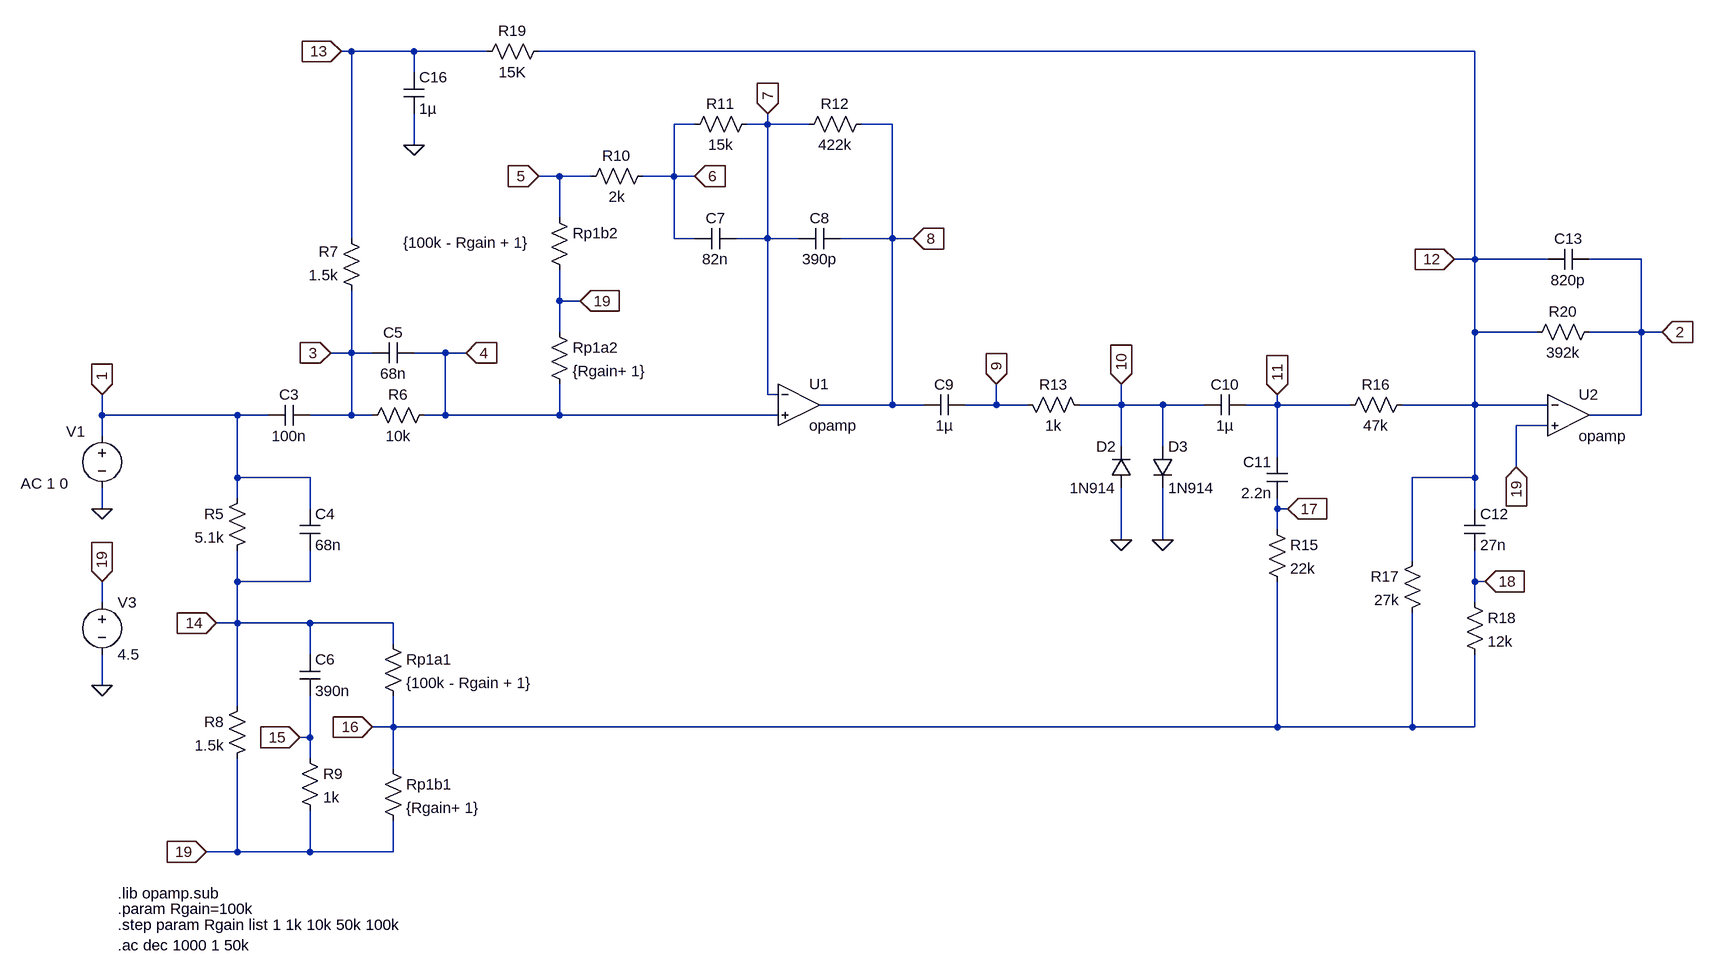
[diagram p0: schematic Klon-Centaur_gain_wo_diodes.asc]
Klon-Centaur_gain_wo_diodes.asc, the LTspice schematic file:
Version 4
SHEET 1 4496 5064
WIRE -32 2000 -48 2000
WIRE 64 2000 -32 2000
WIRE 176 2000 64 2000
WIRE 1696 2000 256 2000
WIRE 64 2032 64 2000
WIRE 496 2112 464 2112
WIRE 608 2112 608 2096
WIRE 608 2112 576 2112
WIRE 672 2112 608 2112
WIRE 800 2112 752 2112
WIRE 64 2144 64 2096
WIRE 288 2192 256 2192
WIRE 336 2192 288 2192
WIRE 464 2192 464 2112
WIRE 464 2192 416 2192
WIRE 496 2192 464 2192
WIRE 288 2256 288 2192
WIRE -32 2288 -32 2000
WIRE 464 2288 464 2192
WIRE 496 2288 464 2288
WIRE 608 2288 608 2112
WIRE 608 2288 560 2288
WIRE 656 2288 608 2288
WIRE 800 2288 800 2112
WIRE 800 2288 720 2288
WIRE 832 2288 800 2288
WIRE 1696 2320 1696 2000
WIRE 1696 2320 1664 2320
WIRE 1808 2320 1696 2320
WIRE 1952 2320 1872 2320
WIRE 288 2384 288 2336
WIRE 320 2384 288 2384
WIRE 288 2432 288 2384
WIRE 1696 2432 1696 2320
WIRE 1792 2432 1696 2432
WIRE 1952 2432 1952 2320
WIRE 1952 2432 1872 2432
WIRE 1984 2432 1952 2432
WIRE -32 2464 -32 2368
WIRE -32 2464 -64 2464
WIRE 0 2464 -32 2464
WIRE 112 2464 64 2464
WIRE 144 2464 112 2464
WIRE 608 2528 608 2288
WIRE 624 2528 608 2528
WIRE 800 2544 800 2288
WIRE 800 2544 688 2544
WIRE 848 2544 800 2544
WIRE 960 2544 960 2512
WIRE 960 2544 912 2544
WIRE 1008 2544 960 2544
WIRE 1152 2544 1152 2512
WIRE 1152 2544 1088 2544
WIRE 1216 2544 1152 2544
WIRE 1280 2544 1216 2544
WIRE 1392 2544 1392 2528
WIRE 1392 2544 1344 2544
WIRE 1504 2544 1392 2544
WIRE 1696 2544 1696 2432
WIRE 1696 2544 1584 2544
WIRE 1808 2544 1696 2544
WIRE -416 2560 -416 2528
WIRE -208 2560 -416 2560
WIRE -160 2560 -208 2560
WIRE -32 2560 -32 2464
WIRE -32 2560 -96 2560
WIRE 0 2560 -32 2560
WIRE 112 2560 112 2464
WIRE 112 2560 80 2560
WIRE 288 2560 288 2512
WIRE 288 2560 112 2560
WIRE 624 2560 288 2560
WIRE 1952 2560 1952 2432
WIRE 1952 2560 1872 2560
WIRE 1808 2576 1760 2576
WIRE -416 2592 -416 2560
WIRE 1152 2608 1152 2544
WIRE 1216 2608 1216 2544
WIRE 1392 2624 1392 2544
WIRE 1760 2640 1760 2576
WIRE -208 2656 -208 2560
WIRE -96 2656 -208 2656
WIRE 1696 2656 1696 2544
WIRE 1696 2656 1600 2656
WIRE -208 2688 -208 2656
WIRE -416 2704 -416 2672
WIRE -96 2704 -96 2656
WIRE 1392 2704 1392 2688
WIRE 1408 2704 1392 2704
WIRE 1696 2704 1696 2656
WIRE 1392 2736 1392 2704
WIRE 1152 2752 1152 2672
WIRE 1216 2752 1216 2672
WIRE 1600 2784 1600 2656
WIRE -208 2816 -208 2768
WIRE -96 2816 -96 2768
WIRE -96 2816 -208 2816
WIRE 1696 2816 1696 2768
WIRE 1712 2816 1696 2816
WIRE -416 2848 -416 2816
WIRE 1696 2848 1696 2816
WIRE -208 2880 -208 2816
WIRE -208 2880 -240 2880
WIRE -96 2880 -208 2880
WIRE 32 2880 -96 2880
WIRE 32 2912 32 2880
WIRE -96 2928 -96 2880
WIRE -416 2976 -416 2928
WIRE -208 3008 -208 2880
WIRE 32 3040 32 2992
WIRE 32 3040 0 3040
WIRE 1392 3040 1392 2816
WIRE 1392 3040 32 3040
WIRE 1600 3040 1600 2864
WIRE 1600 3040 1392 3040
WIRE 1696 3040 1696 2928
WIRE 1696 3040 1600 3040
WIRE -96 3056 -96 2992
WIRE -96 3056 -112 3056
WIRE -96 3088 -96 3056
WIRE 32 3104 32 3040
WIRE -208 3232 -208 3088
WIRE -208 3232 -256 3232
WIRE -96 3232 -96 3168
WIRE -96 3232 -208 3232
WIRE 32 3232 32 3184
WIRE 32 3232 -96 3232
FLAG -256 3232 19
IOPIN -256 3232 In
FLAG -416 2528 1
IOPIN -416 2528 In
FLAG 320 2384 19
IOPIN 320 2384 In
FLAG 1216 2752 0
FLAG 1152 2752 0
FLAG 64 2144 0
FLAG 1760 2640 19
IOPIN 1760 2640 In
FLAG -416 2976 0
FLAG -416 2816 19
IOPIN -416 2816 In
FLAG -416 2704 0
FLAG -64 2464 3
IOPIN -64 2464 In
FLAG -48 2000 13
IOPIN -48 2000 In
FLAG 144 2464 4
IOPIN 144 2464 In
FLAG 256 2192 5
IOPIN 256 2192 In
FLAG 496 2192 6
IOPIN 496 2192 In
FLAG 608 2096 7
IOPIN 608 2096 In
FLAG 832 2288 8
IOPIN 832 2288 In
FLAG 960 2512 9
IOPIN 960 2512 In
FLAG 1152 2512 10
IOPIN 1152 2512 In
FLAG 1392 2528 11
IOPIN 1392 2528 In
FLAG 1408 2704 17
IOPIN 1408 2704 In
FLAG 1712 2816 18
IOPIN 1712 2816 In
FLAG 0 3040 16
IOPIN 0 3040 In
FLAG -112 3056 15
IOPIN -112 3056 In
FLAG -240 2880 14
IOPIN -240 2880 In
FLAG 1664 2320 12
IOPIN 1664 2320 In
FLAG 1984 2432 2
IOPIN 1984 2432 In
SYMBOL voltage -416 2576 R0
WINDOW 0 -55 9 Left 2
WINDOW 123 -125 89 Left 2
WINDOW 39 0 0 Left 0
WINDOW 3 -289 58 Left 2
SYMATTR InstName V1
SYMATTR Value2 AC 1 0
SYMATTR Value ""
SYMBOL res -192 2672 M0
SYMATTR InstName R5
SYMATTR Value 5.1k
SYMBOL res -192 2992 M0
SYMATTR InstName R8
SYMATTR Value 1.5k
SYMBOL cap -96 2544 R90
WINDOW 0 0 32 VBottom 2
WINDOW 3 32 32 VTop 2
SYMATTR InstName C3
SYMATTR Value 100n
SYMBOL cap -112 2704 R0
SYMATTR InstName C4
SYMATTR Value 68n
SYMBOL cap -112 2928 R0
SYMATTR InstName C6
SYMATTR Value 390n
SYMBOL res -112 3072 R0
SYMATTR InstName R9
SYMATTR Value 1k
SYMBOL res 96 2544 R90
WINDOW 0 0 56 VBottom 2
WINDOW 3 32 56 VTop 2
SYMATTR InstName R6
SYMATTR Value 10k
SYMBOL cap 64 2448 R90
WINDOW 0 0 32 VBottom 2
WINDOW 3 32 32 VTop 2
SYMATTR InstName C5
SYMATTR Value 68n
SYMBOL res 16 2896 R0
SYMATTR InstName Rp1a1
SYMATTR Value {100k - Rgain + 1}
SYMBOL res 16 3088 R0
SYMATTR InstName Rp1b1
SYMATTR Value {Rgain+ 1}
SYMBOL res 272 2240 R0
WINDOW 3 -225 54 Left 2
SYMATTR Value {100k - Rgain + 1}
SYMATTR InstName Rp1b2
SYMBOL res 272 2416 R0
SYMATTR InstName Rp1a2
SYMATTR Value {Rgain+ 1}
SYMBOL res 432 2176 R90
WINDOW 0 0 56 VBottom 2
WINDOW 3 32 56 VTop 2
SYMATTR InstName R10
SYMATTR Value 2k
SYMBOL res 592 2096 R90
WINDOW 0 0 56 VBottom 2
WINDOW 3 32 56 VTop 2
SYMATTR InstName R11
SYMATTR Value 15k
SYMBOL cap 560 2272 R90
WINDOW 0 0 32 VBottom 2
WINDOW 3 32 32 VTop 2
SYMATTR InstName C7
SYMATTR Value 82n
SYMBOL cap 720 2272 R90
WINDOW 0 0 32 VBottom 2
WINDOW 3 32 32 VTop 2
SYMATTR InstName C8
SYMATTR Value 390p
SYMBOL res 768 2096 R90
WINDOW 0 0 56 VBottom 2
WINDOW 3 32 56 VTop 2
SYMATTR InstName R12
SYMATTR Value 422k
SYMBOL res 1104 2560 M270
WINDOW 0 32 56 VTop 2
WINDOW 3 0 56 VBottom 2
SYMATTR InstName R13
SYMATTR Value 1k
SYMBOL cap 1408 2624 M0
SYMATTR InstName C11
SYMATTR Value 2.2n
SYMBOL res 1376 2720 R0
SYMATTR InstName R15
SYMATTR Value 22k
SYMBOL res 1616 2768 M0
SYMATTR InstName R17
SYMATTR Value 27k
SYMBOL res 1680 2832 R0
SYMATTR InstName R18
SYMATTR Value 12k
SYMBOL cap 1680 2704 R0
SYMATTR InstName C12
SYMATTR Value 27n
SYMBOL res 1600 2528 R90
WINDOW 0 0 56 VBottom 2
WINDOW 3 32 56 VTop 2
SYMATTR InstName R16
SYMATTR Value 47k
SYMBOL res -16 2384 R180
WINDOW 0 36 76 Left 2
WINDOW 3 36 40 Left 2
SYMATTR InstName R7
SYMATTR Value 1.5k
SYMBOL res 272 1984 R90
WINDOW 0 0 56 VBottom 2
WINDOW 3 32 56 VTop 2
SYMATTR InstName R19
SYMATTR Value 15K
SYMBOL res 1888 2416 R90
WINDOW 0 0 56 VBottom 2
WINDOW 3 32 56 VTop 2
SYMATTR InstName R20
SYMATTR Value 392k
SYMBOL cap 1872 2304 R90
WINDOW 0 0 32 VBottom 2
WINDOW 3 32 32 VTop 2
SYMATTR InstName C13
SYMATTR Value 820p
SYMBOL voltage -416 2832 R0
WINDOW 123 0 0 Left 0
WINDOW 39 0 0 Left 0
SYMATTR InstName V3
SYMATTR Value 4.5
SYMBOL cap 48 2032 R0
SYMATTR InstName C16
SYMATTR Value 1µ
SYMBOL cap 1344 2528 R90
WINDOW 0 0 32 VBottom 2
WINDOW 3 32 32 VTop 2
SYMATTR InstName C10
SYMATTR Value 1µ
SYMBOL cap 912 2528 R90
WINDOW 0 0 32 VBottom 2
WINDOW 3 32 32 VTop 2
SYMATTR InstName C9
SYMATTR Value 1µ
SYMBOL OpAmps\\opamp 656 2480 R0
SYMATTR InstName U1
SYMBOL OpAmps\\opamp 1840 2496 R0
SYMATTR InstName U2
SYMBOL diode 1200 2608 R0
SYMATTR InstName D3
SYMATTR Value 1N914
SYMBOL diode 1168 2672 R180
WINDOW 0 24 64 Left 2
WINDOW 3 24 0 Left 2
SYMATTR InstName D2
SYMATTR Value 1N914
TEXT -392 3320 Left 2 !.param Rgain=100k
TEXT -392 3296 Left 2 !.lib opamp.sub
TEXT -392 3344 Left 2 !.step param Rgain list 1 1k 10k 50k 100k
TEXT -392 3376 Left 2 !.ac dec 1000 1 50k

The netlist it stands for:
* Klon-Centaur_gain_wo_diodes.asc
V1 1 0 AC 1 0
R5 1 14 5.1k
R8 14 19 1.5k
C3 3 1 100n
C4 1 14 68n
C6 14 15 390n
R9 15 19 1k
R6 4 3 10k
C5 4 3 68n
Rp1a1 14 16 {100k - Rgain + 1}
Rp1b1 16 19 {Rgain+ 1}
Rp1b2 5 19 {100k - Rgain + 1}
Rp1a2 19 4 {Rgain+ 1}
R10 6 5 2k
R11 7 6 15k
C7 7 6 82n
C8 8 7 390p
R12 8 7 422k
R13 10 9 1k
C11 11 17 2.2n
R15 17 16 22k
R17 12 16 27k
R18 18 16 12k
C12 12 18 27n
R16 12 11 47k
R7 3 13 1.5k
R19 12 13 15K
R20 2 12 392k
C13 2 12 820p
V3 19 0 4.5
C16 13 0 1µ
C10 11 10 1µ
C9 9 8 1µ
XU1 7 4 8 opamp Aol=100K GBW=10Meg  ; pins invin noninvin out
XU2 12 19 2 opamp Aol=100K GBW=10Meg  ; pins invin noninvin out
D3 10 0 1N914
D2 0 10 1N914
.model D D
.lib standard.dio
.param Rgain=100k
.lib opamp.sub
.step param Rgain list 1 1k 10k 50k 100k
.ac dec 1000 1 50k
.backanno
.end